# Altium schematic sheet Bollbot_V100.SchDoc
size A4
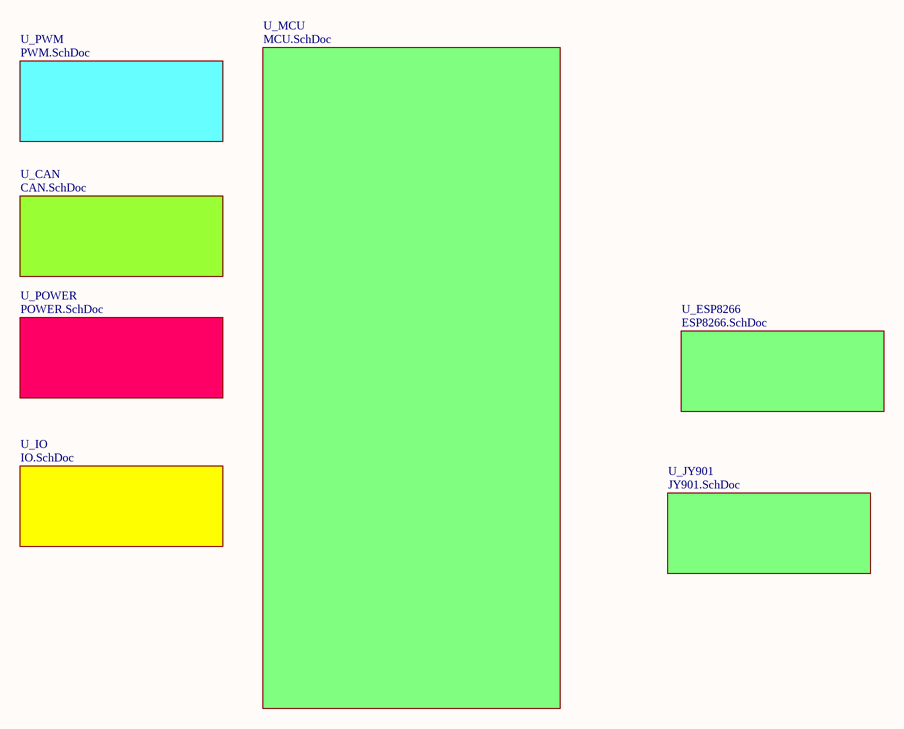
[diagram p0: Bollbot_V100.SchDoc]

## Sub-sheets
U_CAN = CAN.SchDoc: no entries
U_ESP8266 = ESP8266.SchDoc: no entries
U_IO = IO.SchDoc: no entries
U_JY901 = JY901.SchDoc: no entries
U_MCU = MCU.SchDoc: no entries
U_POWER = POWER.SchDoc: no entries
U_PWM = PWM.SchDoc: no entries